# EasyEDA Pro project DRG SPI169-240x280 V1.0_001.eprj

# Schematic Schematic1_1
Create Date: 2023-10-13; Page Name: P1; Project Name: SPI169M1-240x280(1); Schematic Name: Schematic1_1; Update Date: 2023-11-07; Company: 嘉立创EDA; Page Size: A4; Version: V1.0
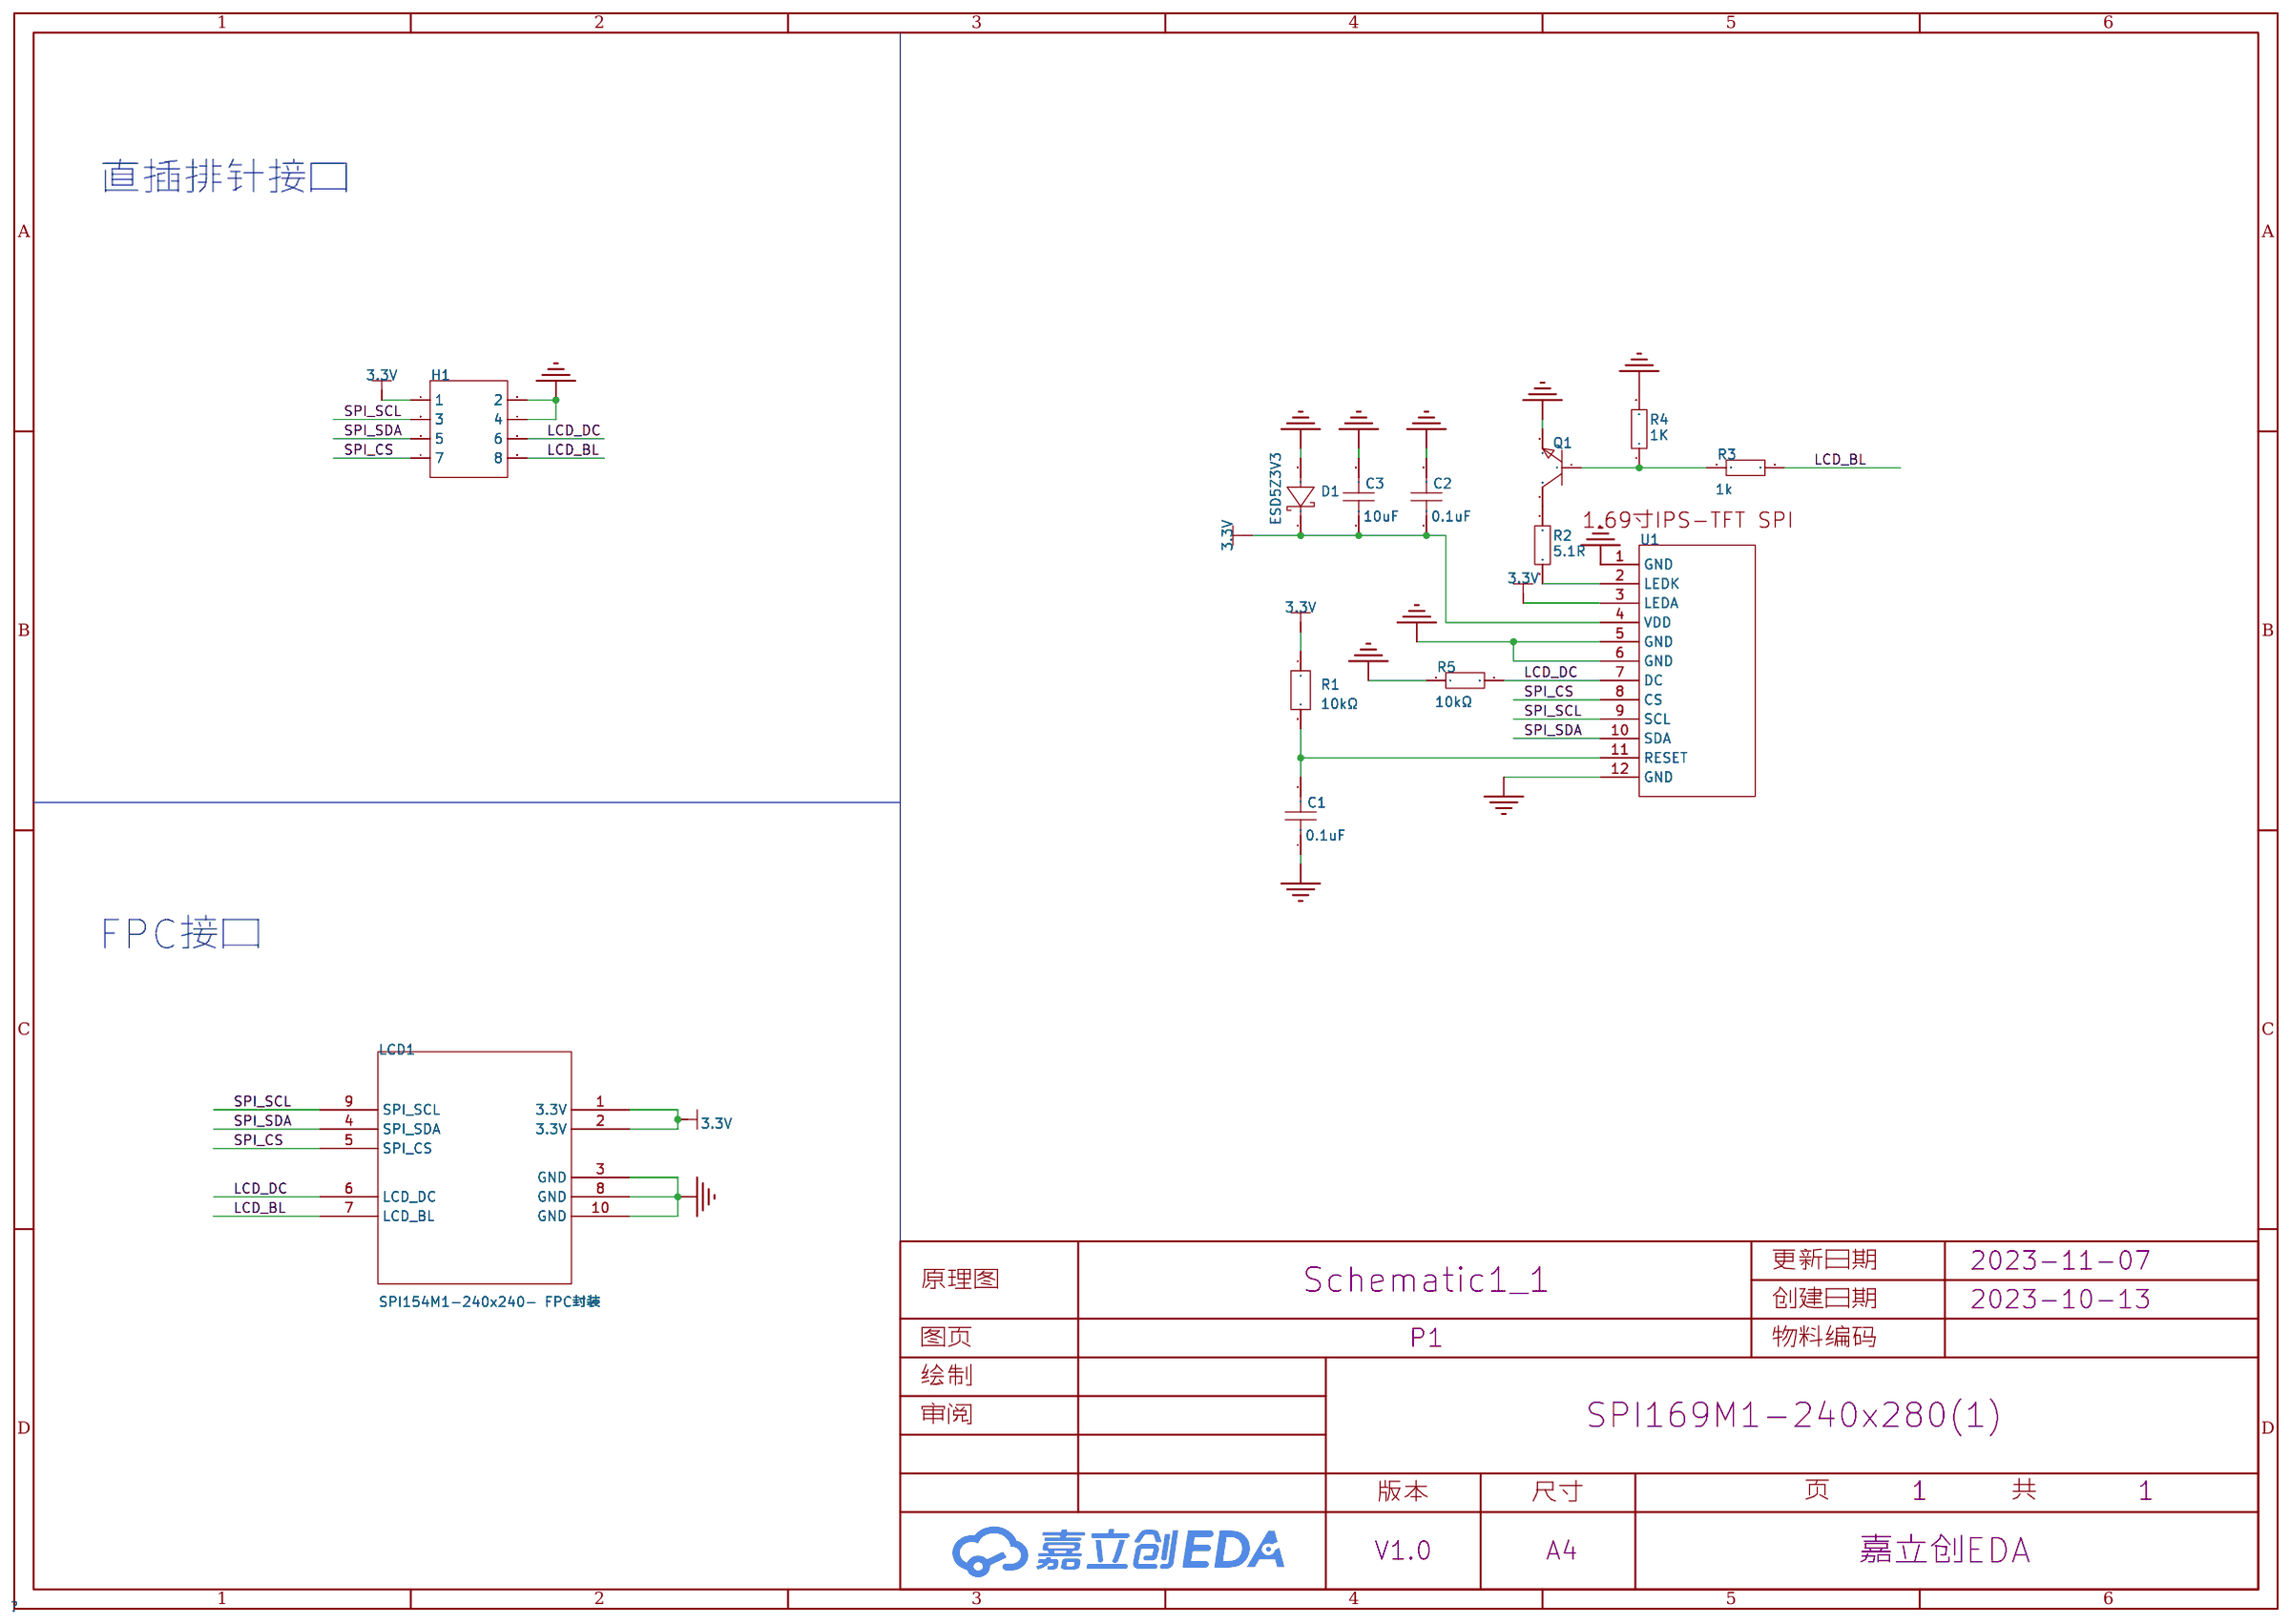
[diagram p0: schematic sheet]

## Parts
C1  0.1uF  [C0603]
C2  0.1uF  [C0603]
C3  10uF  [C0603]
D1  ESD5Z3V3  [SOD-523_L1.2-W0.8-LS1.6-RD]
H1  -  [HDR-TH_8P-P2.54-V-F-R2-C4-S2.54-1]
LCD1  SPI154M1-240x240- FPC封装  [FPC10P-0.5MM]
Q1  -  [S8050_SOT-23]
R1  10kΩ  [R0603]
R2  5.1R  [R0603]
R3  1k  [R0603]
R4  1K  [R0603]
R5  10kΩ  [R0603]
U1  -  [1.54TFT]

## Library data of the parts
C1 C2 = 10uF_C15415: 容值:10uF;精度:±20%;额定电压:16V;材质(温度系数):-;; LCSC Part Name: 10uF ±20% 16V; Supplier Part: C15415; Manufacturer: SAMSUNG(三星); Manufacturer Part: 10uF; Supplier Footprint: 0603; JLCPCB Part Class: 扩展库; Datasheet: https://atta.szlcsc.com/upload/public/pdf/source/20160103/1457707675960.pdf; Supplier: LCSC; Tolerance: ±20%; Voltage Rated: 16V
C3 = 10uF_C15415: 容值:10uF;精度:±20%;额定电压:16V;材质(温度系数):-;; LCSC Part Name: 10uF ±20% 16V; Supplier Part: C15415; Manufacturer: SAMSUNG(三星); Supplier Footprint: 0603; JLCPCB Part Class: 扩展库; Datasheet: https://atta.szlcsc.com/upload/public/pdf/source/20160103/1457707675960.pdf; Supplier: LCSC; Tolerance: ±20%; Voltage Rated: 16V
D1 = ESD5Z3V3: Supplier Part: C727160; Manufacturer: TWGMC(台湾迪嘉); Supplier Footprint: SOD523; JLCPCB Part Class: 扩展库; Datasheet: https://atta.szlcsc.com/upload/public/pdf/source/20200827/C727160_9CE4BFC75199EE08E2423F2D4B5A5CDE.pdf; Supplier: LCSC
H1 = HDR-F_2.54_2x4: Supplier Part: C92271; Supplier Footprint: 插件
LCD1 = SPI154M1-240x240- FPC封装
Q1 = S8050_SOT_NPN: Supplier Footprint: SOT-23
R1 = AT0603BRD0710KL: 电阻类型:薄膜电阻;阻值:10kΩ;精度:±0.1%;功率:100mW;; LCSC Part Name: 10kΩ ±0.1% 100mW; Supplier Part: C723396; Manufacturer: YAGEO(国巨); Supplier Footprint: 0603; JLCPCB Part Class: 扩展库; Datasheet: https://atta.szlcsc.com/upload/public/pdf/source/20200722/C705051_EA338A836C78FCD1C867566BE6F43B3A.pdf; Supplier: LCSC; Type: 薄膜电阻; Tolerance: ±0.1%; Power(Watts): 100mW; Temperature Coefficient: ±25ppm/℃; Overload Voltage (Max): 75V; Operating Temperature Range: -55℃~+155℃
R2-R5 = ETCR0603F10K0K9: 电阻类型:厚膜电阻;阻值:10kΩ;精度:±1%;功率:100mW;; LCSC Part Name: 厚膜电阻 10kΩ ±1% 100mW; Supplier Part: C365375; Manufacturer: RESI(开步睿思）; Supplier Footprint: 0603; JLCPCB Part Class: 扩展库; Datasheet: https://atta.szlcsc.com/upload/public/pdf/source/20190121/C365375_3F533BFFDACCA55449D534AD8E100891.pdf; Supplier: LCSC; Type: 厚膜电阻; Tolerance: ±1%; Power(Watts): 100mW; Temperature Coefficient: ±100ppm/℃; Overload Voltage (Max): 50V; Operating Temperature Range: -55℃~+125℃
U1 = device_bc4a

## Nets
3.3V: C2.1 C3.1 D1.1 H1.1 LCD1.1(3.3V) LCD1.2(3.3V) R1.1 U1.3(LEDA) U1.4(VDD)
GND: C1.1 C2.2 C3.2 D1.2 H1.2 H1.4 LCD1.3(GND) LCD1.8(GND) LCD1.10(GND) Q1.2 R4.2 R5.1 U1.1(GND) U1.5(GND) U1.6(GND) U1.12(GND)
LCD_BL: H1.8 LCD1.7(LCD_BL) R3.2
LCD_DC: H1.6 LCD1.6(LCD_DC) R5.2 U1.7(DC)
SPI_CS: H1.7 LCD1.5(SPI_CS) U1.8(CS)
SPI_SCL: H1.3 LCD1.9(SPI_SCL) U1.9(SCL)
SPI_SDA: H1.5 LCD1.4(SPI_SDA) U1.10(SDA)
$1N1167: C1.2 R1.2 U1.11(RESET)
$1N1324: R2.1 U1.2(LEDK)
$1N1520: Q1.1 R3.1 R4.1
$1N4149: Q1.3 R2.2

## Notes on the sheet
- 直插排针接口
- FPC接口

# Board PCB1_1
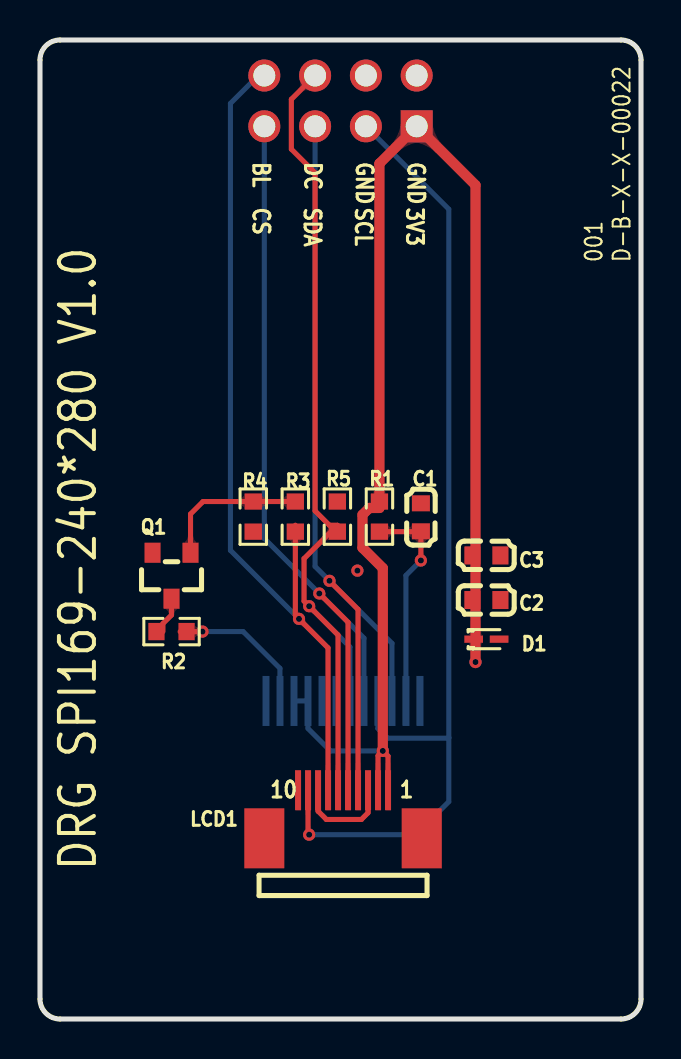
[diagram p1: board, top side]
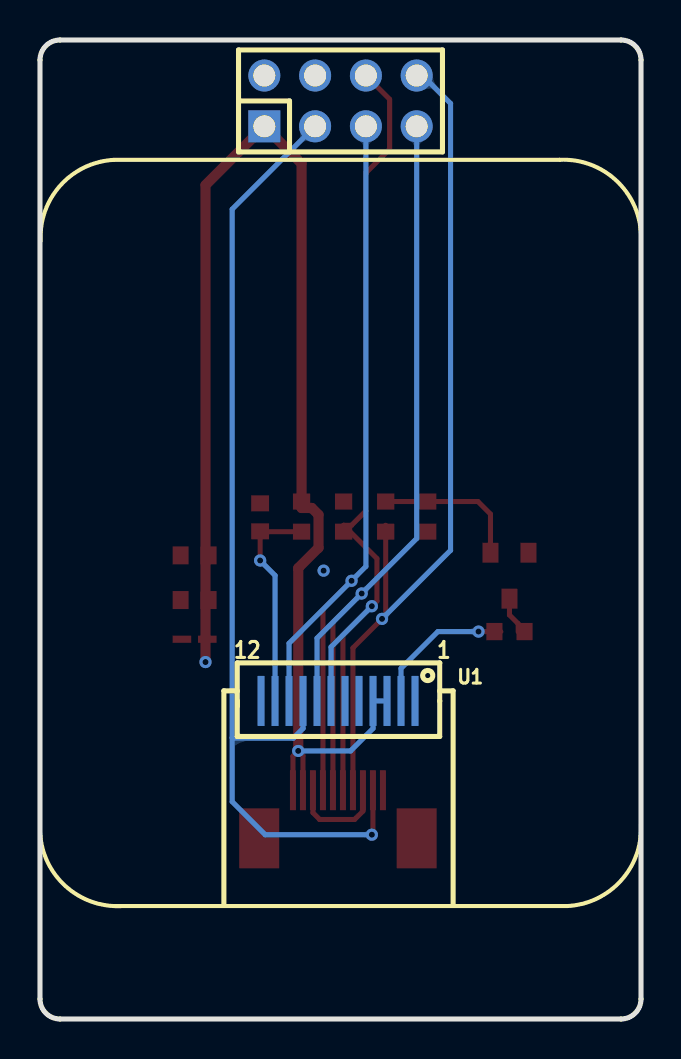
[diagram p2: board, bottom side, seen from below]

Outline 30.06 x 48.97 mm; copper layers: Top Layer, Bottom Layer. Coordinates in mm from the lower left corner of the outline.
Outline path: 0,47.97 0,1 arc(0.29,0.29) 1,0 29.06,0 arc(29.77,0.29) 30.06,1 30.06,47.97 arc(29.77,48.68) 29.06,48.97 1,48.97 arc(0.29,48.68) 0,47.97
Stack: Top Layer 0.035mm / Dielectric1 1.51mm FR4 er 4.5 / Bottom Layer 0.035mm

## Design rules (mm)
template: JLCPCB Capability(Two Layers Board)
spacing copperThickness1oz (default): track to track 0.102, other pairs 0.152 to 0.3
spacing copperThickness2oz: track to track 0.203, other pairs 0.152 to 0.3
track width copperThickness1oz (default): min 0.127, default 0.254, max 2.54
track width copperThickness2oz: min 0.203, default 0.254, max 2.54
differential pair differentialPair (default): width min 0.127, default 0.254, max 2.54; gap min 0.152, default 0.152
via viaSize (default): diameter min 0.5, default 0.61, max 10; hole min 0.3, default 0.305, max 6.3

## Placement (name value [footprint] x y rotation side)
C1  0.1uF  [C0603]  19.05 25.09 270 top
C2  0.1uF  [C0603]  22.33 20.96 0 top
C3  10uF  [C0603]  22.33 23.19 0 top
D1  ESD5Z3V3  [SOD-523_L1.2-W0.8-LS1.6-RD]  22.33 19 0 top
H1  -  [HDR-TH_8P-P2.54-V-F-R2-C4-S2.54-1]  15.03 45.92 180 bottom
LCD1  SPI154M1-240x240- FPC封装  [FPC10P-0.5MM]  15.03 8.97 180 top
Q1  -  [S8050_SOT-23]  6.71 22.17 90 top
R1  10kΩ  [R0603]  16.98 25.13 270 top
R2  5.1R  [R0603]  6.58 19.38 180 top
R3  1k  [R0603]  12.77 25.13 270 top
R4  1K  [R0603]  10.67 25.13 270 top
R5  10kΩ  [R0603]  14.87 25.13 270 top
U1  -  [1.54TFT]  11.3 15.91 0 bottom

## Footprints (pads in the part's own frame, mm; a bottom-side part is the same pattern mirrored in y, then rotated)
1.54TFT
  rect 0.35x2.5 smd: 1(0,0) 2(0.7,0) 3(1.4,0) 4(2.1,0) 5(2.8,0) 6(3.5,0) 7(4.2,0) 8(4.9,0) 9(5.6,0) 10(6.3,0) 11(7,0) 12(7.7,0)
C0603
  rect 0.8x0.9 smd: 1(-0.7,0) 2(0.7,0)
FPC10P-0.5MM
  rect 2x3 smd: 0(-4.064,-0.068) 11(3.809,-0.068)
  rect 0.3x2 smd: 1(-2.377,-2.473) 2(-1.877,-2.473) 3(-1.377,-2.473) 4(-0.877,-2.473) 5(-0.378,-2.473) 6(0.122,-2.473) 7(0.623,-2.473) 8(1.123,-2.473) 9(1.623,-2.473) 10(2.123,-2.473)
HDR-TH_8P-P2.54-V-F-R2-C4-S2.54-1
  rect 1.6x1.6 hole 1.1: 1(-3.81,-1.27)
  round 1.6 hole 1.1: 2(-3.81,1.27) 3(-1.27,-1.27) 4(-1.27,1.27) 5(1.27,-1.27) 6(1.27,1.27) 7(3.81,-1.27) 8(3.81,1.27)
R0603
  rect 0.806x0.864 smd: 1(-0.753,0) 2(0.753,0)
S8050_SOT-23
  rect 1x0.8 smd: 1(1.15,-0.823) 2(1.15,1.077) 3(-1.15,0.127)
SOD-523_L1.2-W0.8-LS1.6-RD
  rect 0.93x0.36 smd: 1(-0.635,0) 2(0.635,0)

## Nets
As in the schematic.

Pads without a net: LCD1 0 11

## Via types
v1: diameter 0.61, hole 0.305, Top Layer to Bottom Layer, 10 vias

## Routing (per net, layer and track width the routed paths; a pad name or vN(x,y) marks a point on that pad's centre or on a via; arc(x,y) is an arc through that point)
3.3V: length 71.7
  Top Layer w0.254: LCD1.1 17.41,13.15 v1(17.15,13.41) 16.91,13.17 LCD1.2 ; D1.1 21.78,19.09
  Top Layer w0.508: v1(17.15,13.41) 17.15,22.55 16.13,23.57 16.13,25.22 16.47,25.56 16.98,25.56 16.98,42.79 H1.1 21.78,41.71 v1(21.78,17.86)
  Bottom Layer w0.254: v1(17.15,13.41) 14.53,13.41 13.4,14.53 U1.4 U1.3
GND: length 5
  Top Layer w0.254: LCD1.3 16.41,10.32 16.07,9.98 14.32,9.98 13.91,10.4 LCD1.8
  vias: v1(15.88,22.43)
LCD_BL: length 43.4
  Top Layer w0.254: 12.77,24.7 12.77,20.2 v1(12.95,20.01) 14.41,18.56 LCD1.7
  Bottom Layer w0.254: v1(12.95,20.01) 9.53,23.44 9.53,45.8 10.92,47.19 H1.8
LCD_DC: length 44.4
  Top Layer w0.254: H1.6 12.57,46 12.57,43.51 13.76,42.32 13.76,25.41 14.48,24.7 14.87,24.7 13.21,23.03 13.21,20.9 v1(13.46,20.65) 14.91,19.2 LCD1.6
  Bottom Layer w0.254: U1.7 15.5,18.61 v1(13.46,20.65)
SPI_CS: length 41.2
  Top Layer w0.254: LCD1.5 15.41,19.85 v1(13.97,21.28)
  Bottom Layer w0.254: U1.8 16.2,19.05 v1(13.97,21.28) 11.22,24.03 H1.7
SPI_SCL: length 50.5
  Top Layer w0.254: LCD1.9 13.41,9.27 v1(13.46,9.22)
  Bottom Layer w0.254: v1(13.46,9.22) 18.8,9.22 20.45,10.87 20.45,14.07 ; U1.9 16.9,14.53 17.39,14.05 20.43,14.05 20.45,14.07 ; 20.45,14.07 20.45,40.5 H1.3
SPI_SDA: length 41.4
  Top Layer w0.254: LCD1.4 15.91,20.49 v1(14.48,21.92)
  Bottom Layer w0.254: U1.10 17.6,18.79 v1(14.48,21.92) 13.76,22.64 H1.5
$1N1167: length 10.9
  Top Layer w0.254: R1.2 19.03,24.38 C1.2 v1(19.05,22.94)
  Bottom Layer w0.254: v1(19.05,22.94) 18.3,22.19 U1.11
$1N1324: length 7.4
  Top Layer w0.254: 7.01,19.38 v1(8.13,19.38)
  Bottom Layer w0.254: v1(8.13,19.38) 10.16,19.38 12,17.54 U1.2
$1N1520: length 7.4
  Top Layer w0.254: 7.53,23.32 7.53,25.26 8.16,25.88 12.77,25.88
$1N4149: length 1.8
  Top Layer w0.254: 6.15,19.38 6.15,19.78 6.58,20.21 6.58,21.02

## Copper pours and planes (outline as drawn; the poured copper is in the pictures)
GND on Top Layer: -2.79,51.38 30.1,51.38 30.1,-0.18 -2.79,-0.18
GND on Bottom Layer: 0,48.97 30.73,48.97 30.73,-0.94 0,-0.94

Small or netless copper shapes (teardrops, artwork), in the pictures only: 39 on Top Layer, 15 on Bottom Layer

## Text on the board
Bottom Silkscreen Layer: 1 | 12
Top Silkscreen Layer: BL | CS | SDA | DC | SCL | GND | 3V3 | 10 | 1 | 001 | D-B-X-X-00022 | DRG SPI169-240*280 V1.0
